# Altium schematic sheet Sheet1.SchDoc
size A4; SheetNumber: 1; SheetTotal: 1
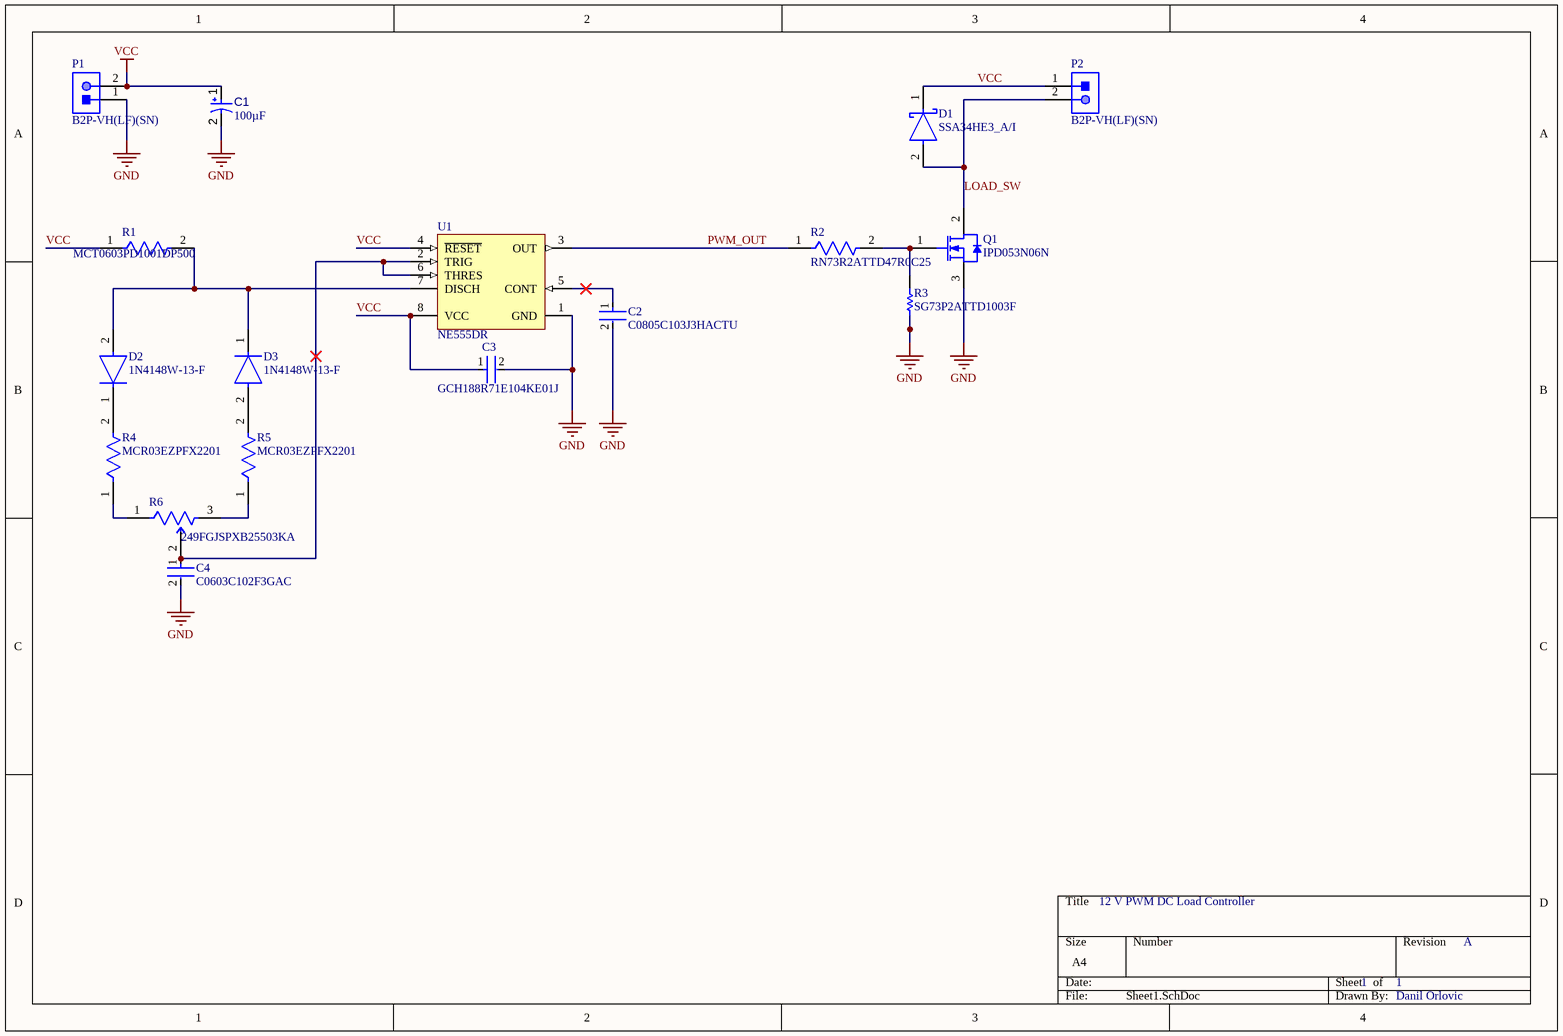
[diagram p0: Sheet1.SchDoc]

## Parts
C1  value 100µF  [CAPPR65-350-1150X800X1250]  (hidden comment: ECA1HM101)
C2  C0805C103J3HACTU  [FP-C0805C-DN-MFG]
C3  GCH188R71E104KE01J  [FP-GCH188-0_1-e0_2_0_5-IPC_A]
C4  C0603C102F3GAC  [FP-C0603C-CF-MFG]
D1  SSA34HE3_A/I  [FP-95400-MFG]
D2  1N4148W-13-F  [FP-SOD123-MFG]
D3  1N4148W-13-F  [FP-SOD123-MFG]
P1  B2P-VH(LF)(SN)  [JST-B2P-VH(LF)(SN)_V]
P2  B2P-VH(LF)(SN)  [JST-B2P-VH(LF)(SN)_V]
Q1  IPD053N06N  [INF-PG-TO252-3-11_A_M]
R1  MCT0603PD1001DP500  [FP-MCT0603-IPC_C]
R2  RN73R2ATTD47R0C25  [FP-RN73R2A-IPC_B]
R3  SG73P2ATTD1003F  [RESC2013X60X30NL20T20]
R4  MCR03EZPFX2201  [FP-MCR03-IPC_C]
R5  MCR03EZPFX2201  [FP-MCR03-IPC_C]
R6  249FGJSPXB25503KA  [FP-249FGJSPXB25503KA-MFG]
U1  NE555DR  [D0008A_N]

## Nets
GND: C1.2 C2.2 C3.2 C4.2 P1.1 Q1.3(SOURCE) R3.1 U1.1(GND)
VCC: C1.1 C3.1 D1.1(C) P1.2 P2.1 R1.1 U1.4(~{RESET}) U1.8(VCC)
LOAD_SW: D1.2(A) P2.2 Q1.2(DRAIN)
PWM_OUT: R2.1 U1.3(OUT)
NetC2_1: C2.1 U1.5(CONT)
NetC4_1: C4.1 R6.2 U1.2(TRIG) U1.6(THRES)
NetD2_1: D2.1(C) R4.2
NetD2_2: D2.2(A) D3.1(C) R1.2 U1.7(DISCH)
NetD3_2: D3.2(A) R5.2
NetQ1_1: Q1.1(GATE) R2.2 R3.2
NetR4_1: R4.1 R6.1
NetR5_1: R5.1 R6.3

## Notes on the sheet
- 12 V PWM DC Load Controller
- 1
- A
- Danil Orlovic

## Library data of the parts
C1 = CMP-001-00026-7: Aluminum Electrolytic Capacitor, 100 uF, +/- 20%, 50 V, -40 to 85 degC, 2-Pin THD, RoHS, Bulk; Manufacturer: Panasonic; Voltage Rating: 50V; Ripple Current: 250mA; Datasheet URL: https://industrial.panasonic.com/cdbs/www-data/pdf/RDF0000/ABA0000C1218.pdf; Lead Pitch: 3.5mm; Mounting Technology: TH; Package Description: 2-Pin Radial Lead, Dia 8 mm, Height 12.5 mm; Diameter: 8mm; Ripple Current (AC): 250mA; Manufacturer URL: http://www.panasonic.com/; Capacitor Type: Electrolytic; Max Operating Temperature: 85°C; Pins: 2; Min Operating Temperature: -40°C; Tolerance: 20%; Case/Package: Radial; Packaging: Bulk; Package Quantity: 200; Package Reference: CAPPR65-350-1150X800X1250; RoHS Compliant: True; Datasheet Version: Rev. 05, 10/2016
C2 = CMP-03020-006789-1: CAP CER 10000PF 25V X8R 0805; Manufacturer: KEMET; Value: 10,000 pF; Tolerance: 0.05; Temperature Coefficient: 30ppm/°C; Material: Ceramic; Temperature Characteristic: X8R; Mouser Description: Multilayer Ceramic Capacitors MLCC - SMD/SMT 25V 10000pF +/-5% X8R; Digikey Description: CAP CER 10000PF 25V X8R 0805; Device Class L2: Capacitors; Device Class L3: Ceramic Capacitors; Category: Cap; Temperature: -55°C to +125°C; Device Class L1: Passive Components; Height: 0.88mm; ComponentLink2Description: Datasheet; Manufacturer Part Number: C0805C103J3HACTU; Automotive: No; ComponentLink2URL: https://content.kemet.com/datasheets/KEM_C1003_C0G_SMD.pdf; Voltage Rating: 25 V; Temperature Range Low: -55°C; Capacitance: 10,000 pF; Lead Free: Yes; RoHS: TRUE; Temperature Range High: +125°C; Ipc Land Pattern Name: CAPC200125X78; Octopart: https://octopart.com/c0805c103j3hactu-kemet-19034692; Package: C0805C-DN
C3 = CMP-06035-036210-1: Ceramic Capacitor 100nF ±10% 25V X7R 0603
C4 = CMP-03020-002782-2: C0603 1,000 pF C0G 30ppm/°C 1.00% 25 V; Manufacturer: KEMET; Material: Ceramic; Tolerance: 0.01; Automotive Grade: Grade 1; Voltage Rating: 25 V; Height: 0.87mm; Lead Free: Yes; Capacitance: 1,000 pF; ComponentLink2URL: https://api.kemet.com/component-edge/download/datasheet/C0603C100J5GACAUTO.pdf; Device Class L3: Ceramic Capacitors; Temperature Coefficient: 30ppm/°C; Automotive: Yes; Value: 1,000 pF; Manufacturer Part Number: C0603C102F3GAC; Octopart: https://octopart.com/c0603c102f3gac-kemet-9143535; Device Class L2: Capacitors; Category: Cap; Mouser Description: Multilayer Ceramic Capacitors MLCC - SMD/SMT 25volts 1000pF 1% C0G; Temperature: -55°C to +125°C; ComponentLink2Description: Datasheet; Temperature Characteristic: C0G; Device Class L1: Passive Components; Temperature Range Low: -55°C; Package: C0603C-CF; RoHS: TRUE; Temperature Range High: +125°C
D1 = CMP-02539-000063-1: DIODE SCHOTTKY 40V 3A DO214AC; Forward Voltage: 380mV; Peak Non-Repetitive Surge Current: 75A; Element Configuration: Single; Max Reverse Current: 17mA; Radiation Hardening: No; Max Operating Temperature: 150°C; Min Operating Temperature: -65°C; Packaging: Tape and Reel; Case/Package: DO-214AC; Forward Current: 3A; Series: Automotive, AEC-Q101; Max Repetitive Reverse Voltage (Vrrm): 40V; Average Rectified Current: 3A; Mount: Surface Mount; Reverse Voltage (DC): 40V; Package Quantity: 7500; RoHS Compliant: Yes; Max Reverse Voltage (DC): 40V; Max Forward Surge Current (Ifsm): 75A
D2 D3 = CMP-12791-000005-1: DIODE GEN PURP 100V 150MA SOD123; Manufacturer: Diodes Inc.; Capacitance: 2pF; Forward Current: 300mA; Max Junction Temp: +150°C; Value: 2pF; Standoff Height: 0mm; Peak Reverse Current: 1uA; Max Surge Forward Current: 1A; Category: Diode; Height: 1.45mm; ComponentLink2URL: https://upverter.com/datasheet/628e7d6fee5901eee6eef4567d1c3569f2cd3cde.pdf; Lead Free: Yes; ComponentLink2Description: Datasheet; Octopart: https://octopart.com/1n4148w-13-f-diodes+inc.-2359612; Temperature Range High: +150°C; Device Class L2: Diodes; Digikey Description: DIODE GEN PURP 100V 150MA SOD123; Reverse Voltage: 100V; Temperature Range Low: -65°C; Device Class L1: Discrete Semiconductors; Package: SOD123; RoHS: TRUE; Manufacturer Part Number: 1N4148W-13-F; Footprint Url: https://www.diodes.com/assets/Package-Files/SOD123.pdf; Automotive: No; Max Repetitive Reverse Voltage: 100V; Mouser Description: 1N4148W Series 2 A 100 V 400 mW Surface Mount Fast Switching Diode - SOD-123; Temperature: -65°C to +150°C; Device Class L3: Rectifier Diodes
P1 P2 = CMP-002-00025-2: Male Header, Pitch 3.96 mm, 1 x 2 Position, Height 10.9 mm, Tail Length 3.7 mm, -25 to 85 degC, RoHS, Bulk; Manufacturer: JST; Case/Package: B2P-VH(LF)(SN); Connector Type: Header; Mounting Technology: TH; Package Reference: B2P-VH(LF)(SN); Package Description: Male Header, Pitch 3.96 mm, 1 x 2 Position, Height 10.9 mm, Tail Length 3.7 mm; Max Operating Temperature: 85°C; Manufacturer URL: http://www.jst.com/home2.html; RoHS Compliant: Unknown; Datasheet Version: May-16; Gender: Male; Min Operating Temperature: -25°C; Datasheet URL: http://www.jst-mfg.com/product/pdf/eng/eVH.pdf
Q1 = CMP-1091-00166-1: N-Channel OptiMOS Power-Transistor, 60 V VDS, 45 A ID, -55 to 175 degC, PG-TO252-3-11, Reel, Green; Manufacturer: Infineon; QG: 27Â nC; IDpuls (max): 180Â A; RthJC (max): 1.8Â K/W; Polarity: N; RDS (on) (max): 5.3Â mOhm; VGS(th) (min): 2.1Â V; VDS (max): 60Â V; Green: TRUE; Ptot (max): 83Â W; VGS(th) (max): 3.3 V; RthJA (max): 62 K/W; ID (max): 45Â A; PartNumber: IPD053N06N; ComponentLink1URL: http://www.infineon.com/; Halogen-free: TRUE; ComponentLink2URL: http://www.infineon.com/dgdl/IPD053N06N_Rev2.2.pdf?folderId=db3a304313b8b5a60113cee8763b02d7&fileId=db3a30433727a44301372c22c4c3499f; ComponentLink3URL: http://www.infineon.com/dgdl/IPD160N04L_rev1.0.pdf?folderId=db3a3043163797a6011643468e7505a4&fileId=db3a3043163797a60116436401cf05cf; PackageReference: PG-TO252-3-11; ComponentLink3Description: Package Specification; Rth: 1.8Â K/W; ComponentLink2Description: Datasheet; ComponentLink1Description: Manufacturer URL; DatasheetVersion: Rev. 2.2; PackageDescription: 3-Pin Plastic (Green) Transistor Single Outline Package, 6.57 x 6.1 mm Body, 2.29 mm Pitch; PackageVersion: Rev. 02, 03/2007; Packing: Reel; Mounting Technology: Surface Mount
R1 = CMP-02407-000265-1: RES SMD 100 OHM 1% 1/8W 0603; Resistance: 1kR; Temperature Coefficient: 25ppm/°C; Tolerance: 0.5%; Max Power Dissipation: 250mW; Case Code (Metric): 1608; Case Code (Imperial): 0603; Number of Terminations: 2; Case/Package: 0603; Features: Automotive AEC-Q200; Max Operating Temperature: 175°C; Min Operating Temperature: -55°C; Composition: Thin Film; Packaging: Tape and Reel
R2 = CMP-04015-007169-1: 47Ω ±0.25% 0.125W, 1/8W Chip Resistor 0805 (2012 Metric) Moisture Resistant Thin Film
R3 = CMP-2001-02617-1: Manufacturer: KOA Speer; Part Number: SG73P2ATTD1003F
R4 R5 = CMP-08839-022897-1: Thick Film Chip Resistor, 0603, 2.2kΩ, 1%, 100ppm/°C, 0.1W, 50V; Resistance: 2.2kR; Power Rating: 100mW; Case Code (Imperial): 0603; Tolerance: 1%; Lead Free: Lead Free; Height: 0.022inch; Packaging: Tape and Reel; Number of Terminations: 2; Mount: Surface Mount; Width: 0.031inch; Min Operating Temperature: -55°C; Features: Automotive AEC-Q200; Max Operating Temperature: 155°C; Contact Plating: Tin; Temperature Coefficient: 100ppm/°C; RoHS Compliant: Yes; Max Power Dissipation: 100mW; Case Code (Metric): 1608; Case/Package: 0603; Resistor Type: Thick Film; Series: MCR03; Length: 0.063inch; Package Quantity: 5000; Size Code: 0603; Voltage Rating (DC): 50V
R6 = CMP-00030-42669055-1: 249FGJSPXB25503KA Res Cermet POT 50K Ohm 20% 1W 1(Elec)/1(Mech)Turn 6.35mm Pin Panel Mount/Through Hole Bulk; Number of Turns: 1; Tolerance: 10%; Voltage Rating: 224V; Insulation Resistance: 1GΩ; Hole Diameter: 9.525mm; Resistance: 50kΩ; Temperature Coefficient: 100ppm/°C; RoHS: Compliant; Length: 12.7mm; NexarPartId: 42669055; Power Rating: 1W; Contact Plating: Tin; Min Operating Temperature: -55°C; Composition: Cermet, Potentiometer; Number of Gangs: 1; Max Operating Temperature: 125°C; Depth: 12.7mm; Termination: Pin; REACH SVHC: Unknown; Type: Potentiometer; Mount: Panel, Through Hole; Military Standard: Not; Height: 13.11mm; Width: 12.7mm
U1 = CMP-016-00007-3: Precision Timer, 4.5 to 16 V, 0 to 70 degC, 8-Pin SOIC (D), Green (RoHS & no Sb/Br), Tape and Reel; Manufacturer: Texas Instruments; Max Ouput Current: -200mA; Frequency: 100kHz; Max Supply Voltage: 16V; Min Supply Voltage: 4.5V; Package Version: 4040047-3/M, 06/2011; Datasheet Version: SLFS022I, 09/2014; Datasheet URL: http://www.ti.com/general/docs/lit/getliterature.tsp?genericPartNumber=NE555&fileType=pdf; Package Reference: D0008A; Min Operating Temperature: 0°C; Case/Package: SOIC; Pins: 8; RoHS Compliant: True; Packaging: TapeandReel; Package Quantity: 2500; Package URL: http://www.ti.com/lit/ml/msoi002j/msoi002j.pdf; Package Description: 8-Pin Small Outline Integrated Circuit, Body 4.9 x 3.9 mm, Pitch 1.27 mm; Mounting Technology: SM; Max Operating Temperature: 70°C; Manufacturer URL: http://www.ti.com/